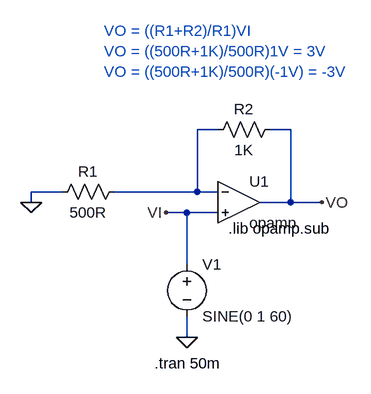
[diagram p0: schematic AMP04 - O Amplificador Não-Inversor.asc]
AMP04 - O Amplificador Não-Inversor.asc, the LTspice schematic file:
Version 4
SHEET 1 880 680
WIRE 144 16 112 16
WIRE 256 16 224 16
WIRE -96 112 -144 112
WIRE 112 112 112 16
WIRE 112 112 -16 112
WIRE 144 112 112 112
WIRE -144 128 -144 112
WIRE 256 128 256 16
WIRE 256 128 208 128
WIRE 304 128 256 128
WIRE 96 144 64 144
WIRE 144 144 96 144
WIRE 96 224 96 144
WIRE 96 336 96 304
FLAG -144 128 0
FLAG 64 144 VI
FLAG 304 128 VO
FLAG 96 336 0
SYMBOL Opamps\\opamp 176 64 R0
SYMATTR InstName U1
SYMBOL res 0 96 R90
WINDOW 0 0 56 VBottom 2
WINDOW 3 32 56 VTop 2
SYMATTR InstName R1
SYMATTR Value 500R
SYMBOL res 240 0 R90
WINDOW 0 0 56 VBottom 2
WINDOW 3 32 56 VTop 2
SYMATTR InstName R2
SYMATTR Value 1K
SYMBOL voltage 96 208 R0
WINDOW 123 0 0 Left 2
WINDOW 39 0 0 Left 2
SYMATTR InstName V1
SYMATTR Value SINE(0 1 60)
TEXT 160 168 Left 2 !.lib opamp.sub
TEXT -32 -136 Left 2 ;VO = ((R1+R2)/R1)VI \nVO = ((500R+1K)/500R)1V = 3V\nVO = ((500R+1K)/500R)(-1V) = -3V
TEXT 46 376 Left 2 !.tran 50m

The netlist it stands for:
* AMP04 - O Amplificador Não-Inversor.asc
XU1 N001 VI VO opamp Aol=100K GBW=10Meg  ; pins invin noninvin out
R1 N001 0 500R
R2 VO N001 1K
V1 VI 0 SINE(0 1 60)
.lib opamp.sub
* VO = ((R1+R2)/R1)VI
* VO = ((500R+1K)/500R)1V = 3V
* VO = ((500R+1K)/500R)(-1V) = -3V
.tran 50m
.backanno
.end